# EAGLE design tree-3d-r1 (EAGLE 5.12)
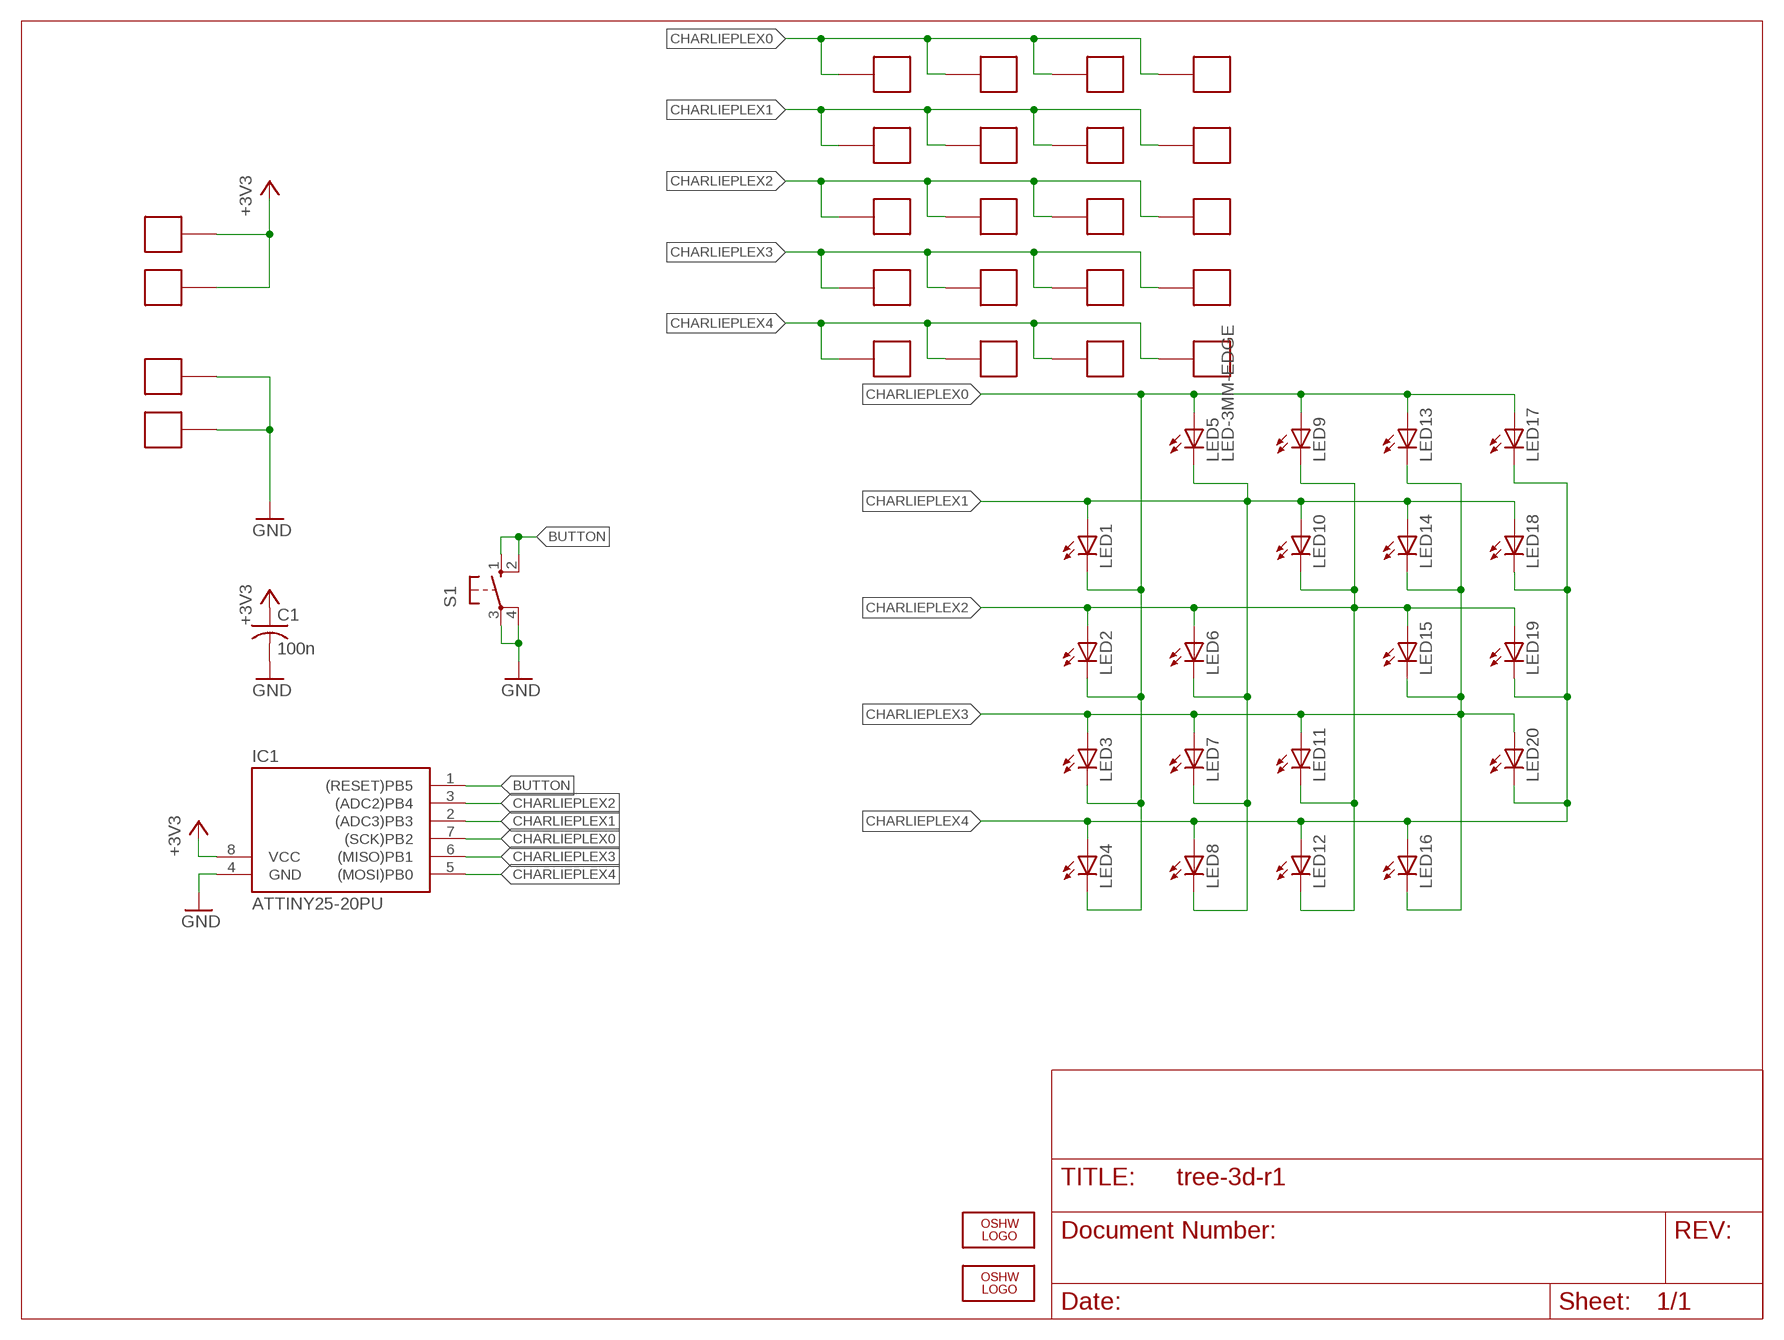
[diagram p0: schematic, sheet 1]

## Parts
C1  100n  C-US050-025X075  [C050-025X075]
IC1  ATTINY25-20PU  TINY138P3  [DIL08]
LED1  LED3MM  [LED3MM]
LED2  LED3MM  [LED3MM]
LED3  LED3MM  [LED3MM]
LED4  LED3MM  [LED3MM]
LED5  LED-3MM-EDGE  [LED-3MM-EDGE]
LED6  LED3MM  [LED3MM]
LED7  LED3MM  [LED3MM]
LED8  LED3MM  [LED3MM]
LED9  LED3MM  [LED3MM]
LED10  LED3MM  [LED3MM]
LED11  LED3MM  [LED3MM]
LED12  LED3MM  [LED3MM]
LED13  LED3MM  [LED3MM]
LED14  LED3MM  [LED3MM]
LED15  LED3MM  [LED3MM]
LED16  LED3MM  [LED3MM]
LED17  LED3MM  [LED3MM]
LED18  LED3MM  [LED3MM]
LED19  LED3MM  [LED3MM]
LED20  LED3MM  [LED3MM]
LOGO1  OSHW_LOGO_FILLX0100-NT  [OSHW_FILLX100_NOTEXT]
LOGO2  OSHW_LOGO_FILLX0100-NT  [OSHW_FILLX100_NOTEXT]
S1  10-XX  [B3F-10XX]
X1  PAD-3X5  [PAD-3X5]
X2  PAD-3X5  [PAD-3X5]
X3  PAD-1.5X3  [PAD-1.5X3]
X4  PAD-1.5X3  [PAD-1.5X3]
X5  PAD-1.5X3  [PAD-1.5X3]
X6  PAD-1.5X3  [PAD-1.5X3]
X7  PAD-3X5  [PAD-3X5]
X8  PAD-3X5  [PAD-3X5]
X9  PAD-1.5X3  [PAD-1.5X3]
X10  PAD-1.5X3  [PAD-1.5X3]
X11  PAD-3X5  [PAD-3X5]
X12  PAD-3X5  [PAD-3X5]
X13  PAD-1.5X3  [PAD-1.5X3]
X14  PAD-1.5X3  [PAD-1.5X3]
X15  PAD-3X5  [PAD-3X5]
X16  PAD-3X5  [PAD-3X5]
X17  PAD-3X5  [PAD-3X5]
X18  PAD-3X5  [PAD-3X5]
X19  PAD-1.5X3  [PAD-1.5X3]
X20  PAD-1.5X3  [PAD-1.5X3]
X21  PAD-2X4  [PAD-2X4]
X22  PAD-2X4  [PAD-2X4]
X23  PAD-2X4  [PAD-2X4]
X24  PAD-2X4  [PAD-2X4]

## Nets
+3V3: C1.1 IC1.8(VCC) X21.P$1 X22.P$1
BUTTON: IC1.1((RESET)PB5) S1.1(S) S1.2(S1)
CHARLIEPLEX0: IC1.7((SCK)PB2) LED1.K(C) LED2.K(C) LED3.K(C) LED4.K(C) LED5.A LED9.A LED13.A LED17.A X1.P$1 X2.P$1 X3.P$1 X4.P$1
CHARLIEPLEX1: IC1.2((ADC3)PB3) LED1.A LED5.K(C) LED6.K(C) LED7.K(C) LED8.K(C) LED10.A LED14.A LED18.A X5.P$1 X6.P$1 X7.P$1 X8.P$1
CHARLIEPLEX2: IC1.3((ADC2)PB4) LED2.A LED6.A LED9.K(C) LED10.K(C) LED11.K(C) LED12.K(C) LED15.A LED19.A X9.P$1 X10.P$1 X11.P$1 X12.P$1
CHARLIEPLEX3: IC1.6((MISO)PB1) LED3.A LED7.A LED11.A LED13.K(C) LED14.K(C) LED15.K(C) LED16.K(C) LED20.A X13.P$1 X14.P$1 X15.P$1 X16.P$1
CHARLIEPLEX4: IC1.5((MOSI)PB0) LED4.A LED8.A LED12.A LED16.A LED17.K(C) LED18.K(C) LED19.K(C) LED20.K(C) X17.P$1 X18.P$1 X19.P$1 X20.P$1
GND: C1.2 IC1.4(GND) S1.3(P) S1.4(P1) X23.P$1 X24.P$1

## Library data of the parts
C1 = rcl:C-US: CAPACITOR, American symbol
IC1 = avr-5:TINY13*
LED1-LED4 LED6-LED20 = led:LED: LED OSRAM: - CHIPLED LG R971, LG N971, LY N971, LG Q971, LY Q971, LO R971, LY R971 LH N974, LH R974 LS Q976, LO Q976, LY Q976 LO Q996 - Hyper CHIPLED LW Q18S LB Q993, LB Q99A, LB R99A - SideLED LS A670, LO A670, LY A670, LG A670, LP A670 LB A673, LV A673, LT A673, LW A673 LH A674 LY A675 LS A676, LA A676, LO A676, LY A676, LW A676 LS A679, LY A679, LG A679 - Hyper Micro SIDELED® LS Y876, LA Y876, LO Y876, LY Y876 LT Y87S - SmartLED LW L88C, LW L88S LB L89C, LB L89S, LG L890 LS L89K, LO L89K, LY L89K LS L896, LA L896, LO L896, LY L896 - TOPLED LS T670, LO T670, LY T670, LG T670, LP T670 LSG T670, LSP T670, LSY T670, LOP T670, LYG T670 LG T671, LOG T671, LSG T671 LB T673, LV T673, LT T673, LW T673 LH T674 LS T676, LA T676, LO T676, LY T676, LB T676, LH T676, LSB T676, LW T676 LB T67C, LV T67C, LT T67C, LS T67K, LO T67K, LY T67K, LW E67C LS E67B, LA E67B, LO E67B, LY E67B, LB E67C, LV E67C, LT E67C LW T67C LS T679, LY T679, LG T679 LS T770, LO T770, LY T770, LG T770, LP T770 LB T773, LV T773, LT T773, LW T773 LH T774 LS E675, LA E675, LY E675, LS T675 LS T776, LA T776, LO T776, LY T776, LB T776 LHGB T686 LT T68C, LB T68C - Hyper Mini TOPLED® LB M676 - Mini TOPLED Santana® LG M470 LS M47K, LO M47K, LY M47K Source: http://www.osram.convergy.de LUXEON: - LUMILED® LXK2-PW12-R00, LXK2-PW12-S00, LXK2-PW14-U00, LXK2-PW14-V00 LXK2-PM12-R00, LXK2-PM12-S00, LXK2-PM14-U00 LXK2-PE12-Q00, LXK2-PE12-R00, LXK2-PE12-S00, LXK2-PE14-T00, LXK2-PE14-U00 LXK2-PB12-K00, LXK2-PB12-L00, LXK2-PB12-M00, LXK2-PB14-N00, LXK2-PB14-P00, LXK2-PB14-Q00 LXK2-PR12-L00, LXK2-PR12-M00, LXK2-PR14-Q00, LXK2-PR14-R00 LXK2-PD12-Q00, LXK2-PD12-R00, LXK2-PD12-S00 LXK2-PH12-R00, LXK2-PH12-S00 LXK2-PL12-P00, LXK2-PL12-Q00, LXK2-PL12-R00 Source: www.luxeon.com KINGBRIGHT: KA-3528ASYC Source: www.kingbright.com
LED5 = rbg-generic-leds:LED
LOGO1 LOGO2 = ohw-logo:OSHW_LOGO_FILL
S1 = rbg-generic-tact-switch:10-XX: OMRON SWITCH
X1-X24 = rbg-generic-pads:PAD

## Board
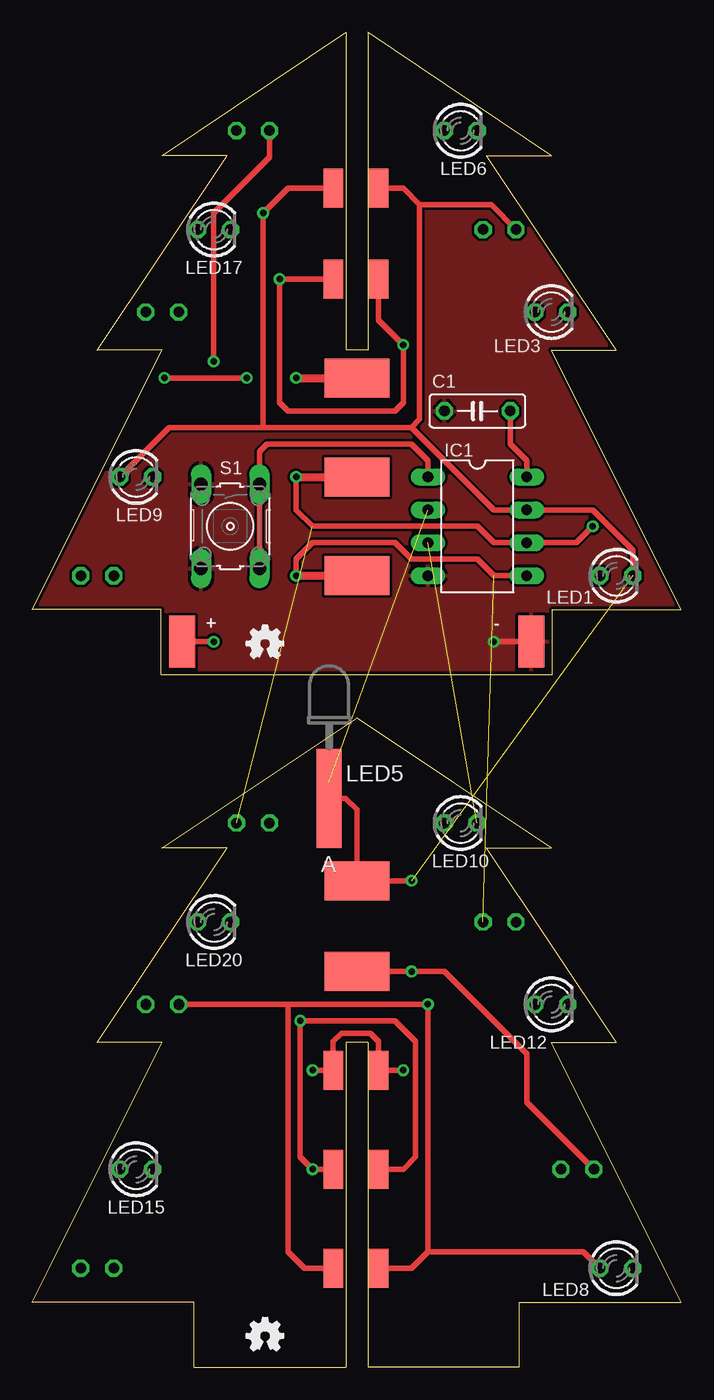
[diagram p1: board, top side]
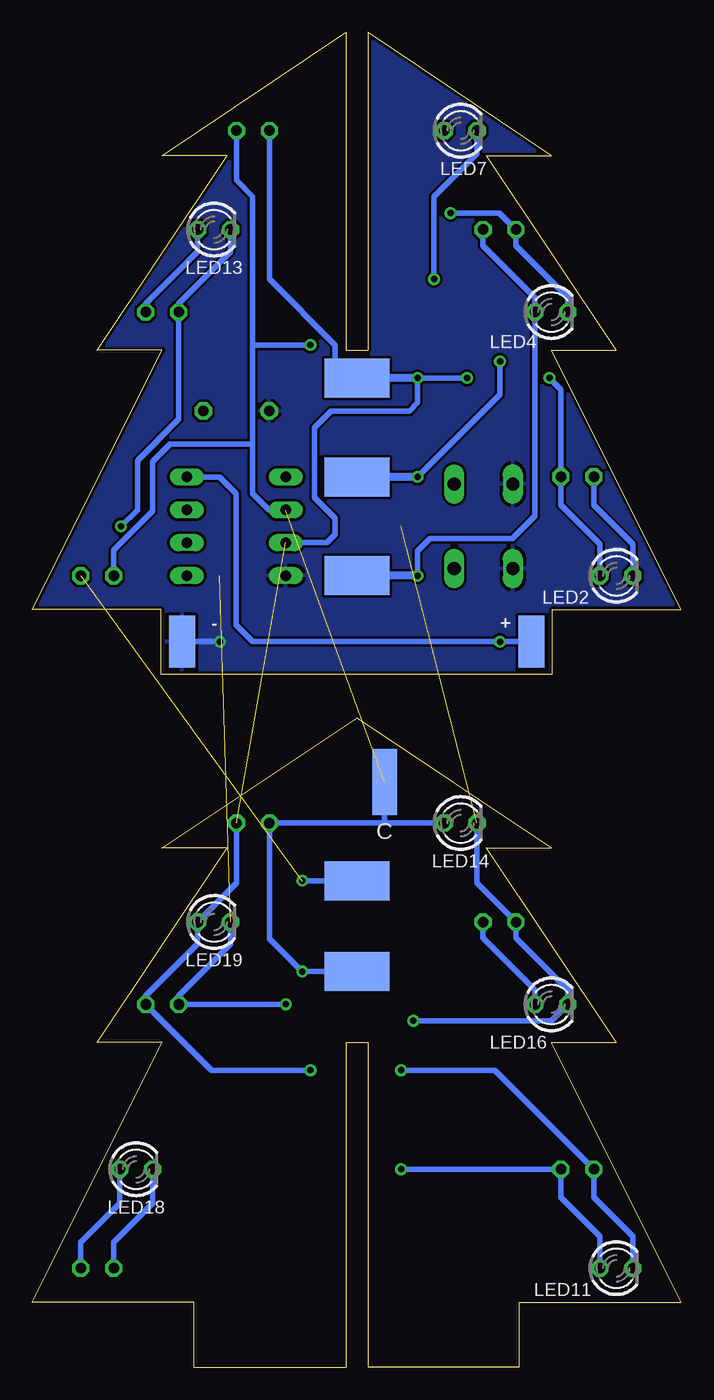
[diagram p2: board, bottom side, seen from below]

Size 50 x 102.82 mm. Coordinates in mm from the lower left corner, seen from the top.
Outline: 12.46,0 24.15,0 24.15,25 25.85,25 25.85,0 37.54,0 37.54,5 50,5 40,25 45,25 35,40 40,40 25,50 10,40 15,40 5,25 10,25 0,5 12.46,5 12.46,0
Outline: 9.92,53.34 9.92,58.34 0,58.34 10,78.34 5,78.34 15,93.34 10,93.34 24.15,102.82 24.15,78.34 25.85,78.34 25.85,102.82 40,93.34 35,93.34 45,78.34 40,78.34 50,58.34 40.08,58.34 40.08,53.34 9.92,53.34
Copper layers (1*16): Top 0.035mm / dielectric 1.5mm / Bottom 0.035mm
Design rules "default *": minimum track width 10mil, minimum drill 24mil, track to track 8mil, track to pad 8mil, pad to pad 8mil, via to via 8mil, smd to smd 8mil, copper to edge 10mil, drill to drill 8mil, minimum pad ring 10mil, minimum via ring 8mil, stop-mask expansion 4mil, vias tented up to drill 0mil, thermal gap 10mil

### Footprints (pad centres in the part's own frame; a part is rotated, then mirrored left to right if it is on the bottom)
C050-025X075 = drill 0.813 octagon: 1 -2.54,0; 2 2.54,0
DIL08 = drill 0.813 long: 1 -3.81,-3.81; 2 -1.27,-3.81; 3 1.27,-3.81; 4 3.81,-3.81; 5 3.81,3.81; 6 1.27,3.81; 7 -1.27,3.81; 8 -3.81,3.81
LED3MM = drill 0.813 octagon: A -1.27,0; K 1.27,0
LED-3MM-EDGE = smd 1.905 x 7.62: A 0,-3.81 | smd 1.905 x 5.08 bottom: K 0,-2.54
B3F-10XX = drill 1.016 long: 1 -3.251,2.261; 2 3.251,2.261; 3 -3.251,-2.261; 4 3.251,-2.261
PAD-3X5 = smd 5 x 3: P$1 0,0
PAD-1.5X3 = smd 3 x 1.5: P$1 0,0
PAD-2X4 = smd 4 x 2: P$1 0,0

### Placement (x,y rotation side)
C1  34.29,73.66 180 top
IC1  34.29,64.77 270 top
LED1  45,60.96 0 top
LED2  5,60.96 0 bottom
LED3  40,81.28 0 top
LED4  10,81.28 0 bottom
LED5  22.86,47.62 0 top
LED6  33,95.25 0 top
LED7  17,95.25 0 bottom
LED8  45,7.62 0 top
LED9  8,68.58 0 top
LED10  33,41.91 0 top
LED11  5,7.62 0 bottom
LED12  40,27.94 0 top
LED13  36,87.63 0 bottom
LED14  17,41.91 0 bottom
LED15  8,15.24 0 top
LED16  10,27.94 0 bottom
LED17  14,87.63 0 top
LED18  42,15.24 0 bottom
LED19  36,34.29 0 bottom
LED20  14,34.29 0 top
LOGO1  16.51,1.27 0 top
LOGO2  16.51,54.61 0 top
S1  15.24,64.77 270 top
X1  25,37.47 0 top
X2  25,37.47 0 bottom
X3  23.18,90.81 90 top
X4  26.67,90.81 90 top
X5  23.18,83.82 90 top
X6  26.67,83.82 90 top
X7  25,30.48 0 top
X8  25,30.48 0 bottom
X9  23.18,22.86 90 top
X10  26.67,22.86 90 top
X11  25,76.2 0 bottom
X12  25,76.2 0 top
X13  23.18,15.24 90 top
X14  26.67,15.24 90 top
X15  25,68.58 0 top
X16  25,68.58 0 bottom
X17  25,60.96 0 top
X18  25,60.96 0 bottom
X19  23.18,7.62 90 top
X20  26.67,7.62 90 top
X21  11.54,55.88 270 bottom
X22  11.54,55.88 90 top
X23  38.46,55.88 270 bottom
X24  38.46,55.88 90 top

### Tracks (layer width: path | path; a pad name or v marks a point on that pad's centre or on a via)
+3V3  (via drill 0.5)
  Top 0.406: IC1.8 38.1,69.85 36.83,71.12 C1.1 | v13.97,55.88 X21.P$1
  Bottom 0.406: IC1.8 35.56,68.58 34.29,67.31 34.29,57.15 33.02,55.88 v13.97,55.88 12.7,55.88 X21.P$1
BUTTON
  Top 0.406: IC1.1 30.48,69.85 29.21,71.12 18.1,71.12 17.5,70.52 S1.1 S1.2
CHARLIEPLEX0  (via drill 0.5)  (1 unrouted)
  Top 0.406: X4.P$1 28.57,90.81 29.84,89.53 | 29.84,89.53 29.84,73.03 29.21,72.39 | 17.78,72.39 29.21,72.39 | 17.78,72.39 v17.78,88.9 19.68,90.81 X3.P$1 | 29.21,72.39 35.56,66.04 IC1.7 43.18,66.04 46.27,62.95 LED1.K | v29.21,37.47 X2.P$1 25,42.95 24.13,43.82 LED5.A | 17.78,72.39 10.54,72.39 LED9.A | 29.84,89.53 35.37,89.53 LED13.A
  Bottom 0.406: X2.P$1 v29.21,37.47 | LED2.K 3.73,63.42 6.73,66.42 LED9.A | LED4.K 8.73,82.39 12.73,86.39 LED17.A 14,88.9 v17.78,88.9 | LED3.K 41.27,81.92 37.27,85.92 LED13.A
CHARLIEPLEX1  (via drill 0.5)  (1 unrouted)
  Top 0.406: X6.P$1 26.67,80.65 v28.57,78.74 28.57,74.3 27.94,73.66 19.68,73.66 19.05,74.3 v19.05,83.82 X5.P$1 | X7.P$1 v29.21,30.48 31.75,30.48 38.1,24.13 38.1,20.41 LED18.A
  Bottom 0.406: IC1.2 31.75,66.04 33.02,67.31 33.02,71.12 | 33.02,78.74 33.02,71.12 | v28.57,78.74 33.02,78.74 | LED8.K 46.27,9.61 43.27,12.61 LED18.A | X7.P$1 v29.21,30.48 31.73,33 LED10.A 22.86,41.91 | 22.86,41.91 LED14.A | LED1.A 43.73,62.95 40.73,65.95 40.73,69.76 39.37,71.12 33.02,71.12 | v19.05,83.82 19.05,90.17 15.73,93.49 LED7.K | LED6.K 34.27,91.42 33.02,90.17 33.02,78.74 | 22.86,41.91 LED5.K
CHARLIEPLEX2  (via drill 0.5)  (1 unrouted)
  Top 0.406: v21.59,22.86 X9.P$1 23.18,25.08 23.81,25.72 26.04,25.72 26.67,25.08 X10.P$1 v28.57,22.86 | v10.16,76.2 v16.51,76.2
  Top 0.61: v20.32,76.2 X11.P$1
  Bottom 0.406: IC1.3 27.3,63.5 26.67,64.14 26.67,65.41 28.26,66.99 28.26,72.39 26.99,73.66 20.95,73.66 20.32,74.3 v20.32,76.2 v16.51,76.2 | LED11.K 3.73,10.08 6.73,13.08 LED15.A 14.35,22.86 v21.59,22.86 | LED10.K 34.27,37.29 LED19.A 37.27,32.58 41.27,28.58 LED12.K 36.19,22.86 v28.57,22.86 | LED2.A 6.27,63.42 9.27,66.42 LED9.K 9.27,75.31 v10.16,76.2 | LED6.A 31.73,83.8 26.67,78.74 26.67,77.47 25.4,76.2 X11.P$1
  Bottom 0.61: v20.32,76.2 X11.P$1
CHARLIEPLEX3  (via drill 0.5)  (1 unrouted)
  Top 0.406: v20.32,68.58 20.32,66.04 21.59,64.77 34.29,64.77 35.56,63.5 IC1.6 41.91,63.5 v43.18,64.77 | X14.P$1 28.57,15.24 29.53,16.19 29.53,25.08 27.94,26.67 v20.64,26.67 20.64,16.19 v21.59,15.24 X13.P$1 | LED7.A 18.27,93.2 13.97,88.9 v13.97,77.47
  Top 0.61: v20.32,68.58 X15.P$1
  Bottom 0.406: LED11.A 6.27,10.08 9.27,13.08 LED15.K v21.59,15.24 | LED14.K 15.73,37.29 LED20.A 12.73,33.05 8.73,29.05 LED16.K 10,26.67 v20.64,26.67 | LED13.K 34.73,85.92 38.73,81.92 LED3.A 38.73,73.03 41.91,69.85 41.91,66.04 v43.18,64.77 | v13.97,77.47 13.97,74.93 v20.32,68.58
  Bottom 0.61: v20.32,68.58 X15.P$1
CHARLIEPLEX4  (via drill 0.5)  (1 unrouted)
  Top 0.406: IC1.5 35.56,60.96 34.29,62.23 29.21,62.23 27.94,63.5 21.59,63.5 20.32,62.23 v20.32,60.96 | X20.P$1 29.21,7.62 30.48,8.89 | 30.48,8.89 v30.48,27.94 19.68,27.94 | X19.P$1 20.95,7.62 19.68,8.89 19.68,27.94 | 19.68,27.94 LED16.A | 30.48,8.89 42.46,8.89 LED8.A
  Top 0.61: v20.32,60.96 X18.P$1
  Bottom 0.406: LED19.K 34.73,32.58 38.73,28.58 LED12.A v30.48,27.94 | LED16.A 11.27,29.05 15.27,33.05 LED20.K | LED8.A 43.73,9.61 40.73,12.61 LED18.K | LED17.K 15.27,86.39 11.27,82.39 LED4.A 11.27,65.56 13.02,63.82 19.37,63.82 20.32,62.87 v20.32,60.96
  Bottom 0.61: v20.32,60.96 X18.P$1
GND  (via drill 0.5)
  Top 0.406: v35.56,55.88 X24.P$1
  Bottom 0.406: v35.56,55.88 X24.P$1
  pour Top: -1.27,52.07 50.8,52.07 50.8,102.87 -1.27,102.87
  pour Bottom: -1.27,52.07 50.8,52.07 50.8,102.87 -1.27,102.87

### Text on the board
tNames: + | -
bNames: + | -